# Altium project ST-Link V2.PrjPCB
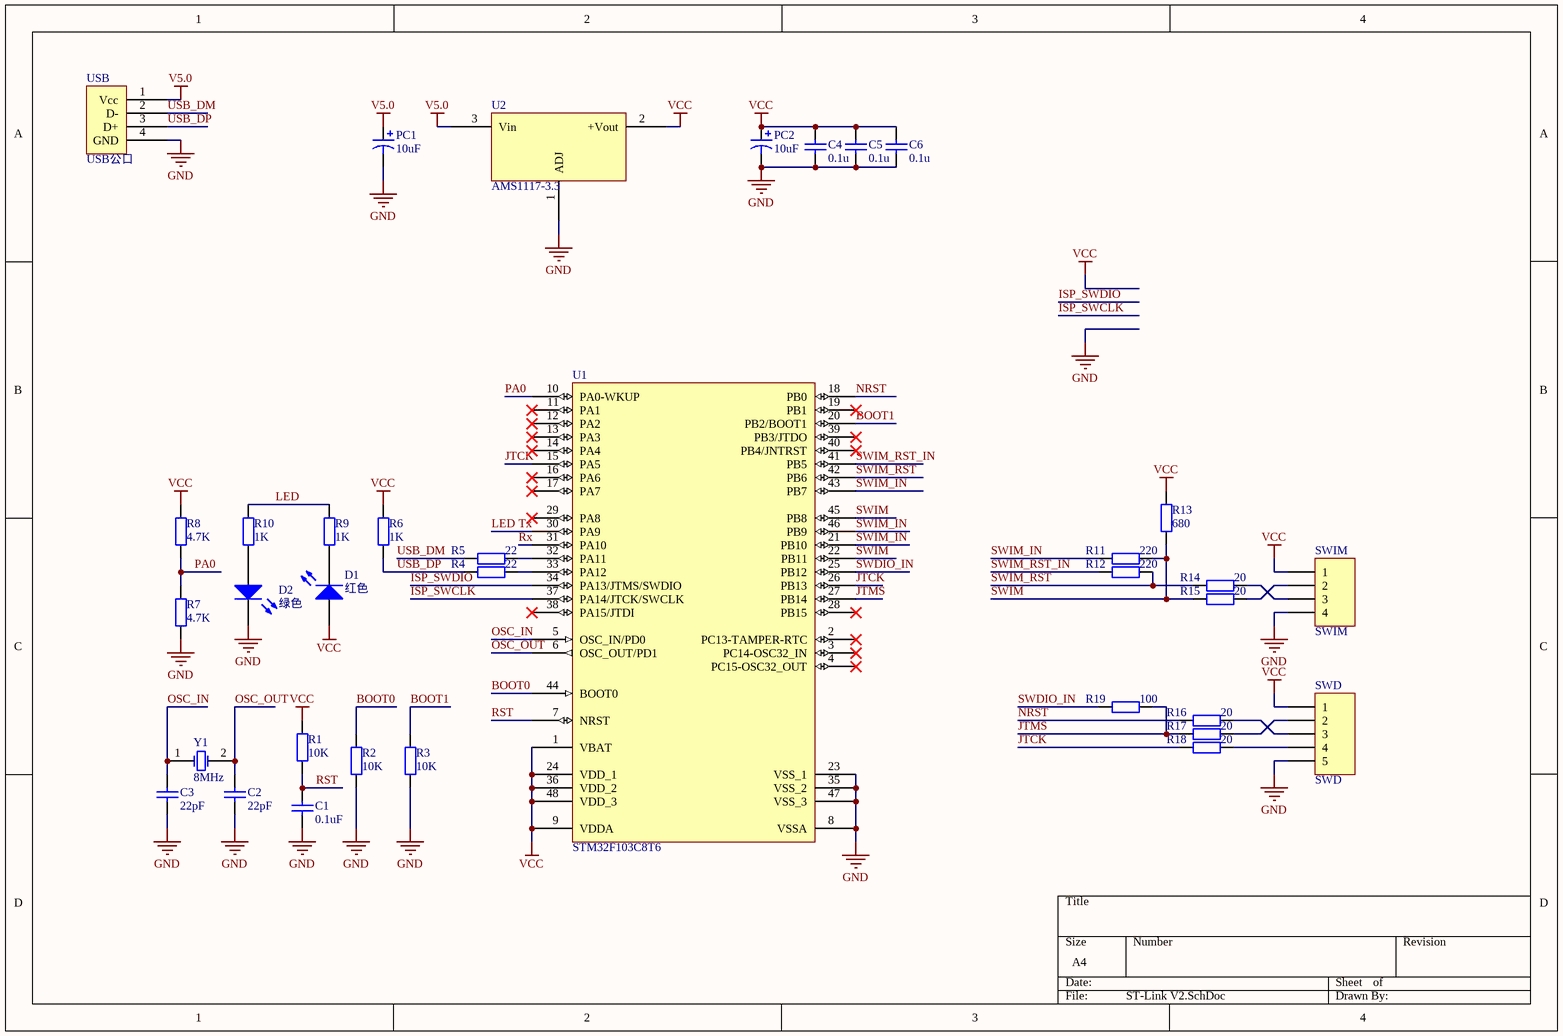
[diagram p0: ST-Link V2.SchDoc]
1 sheet, 35 parts. Net scope: global (net labels, ports and power ports of the same name join across sheets).
Board file: ST-Link V2.PcbDoc

## Sheet ST-Link V2.SchDoc
size A4

### Parts
C1  value 0.1uF  [C0603]
C2  value 22pF  [C0603]
C3  value 22pF  [C0603]
C4  value 0.1u  [C0603]
C5  value 0.1u  [C0603]
C6  value 0.1u  [C0603]
D1  红色  [LED0603]
D2  绿色  [LED0603]
PC1  value 10uF  [C1206A]
PC2  value 10uF  [C1206A]
R1  value 10K  [R0603]
R2  value 10K  [R0603]
R3  value 10K  [R0603]
R4  value 22  [R0603]
R5  value 22  [R0603]
R6  value 1K  [R0603]
R7  value 4.7K  [R0603]
R8  value 4.7K  [R0603]
R9  value 1K  [R0603]
R10  value 1K  [R0603]
R11  value 220  [R0603]
R12  value 220  [R0603]
R13  value 680  [R0603]
R14  value 20  [R0603]
R15  value 20  [R0603]
R16  value 20  [R0603]
R17  value 20  [R0603]
R18  value 20  [R0603]
R19  value 100  [R0603]
SWD  SWD  [HDR1X5]
SWIM  SWIM  [HDR1X4]
U1  STM32F103C8T6  [LQFP48_M]
U2  AMS1117-3.3  [SOT-223]
USB  USB公口  [USB-H]
Y1  8MHz  [JZ]

### Nets
GND: C1.2 C2.2 C3.2 C4.2 C5.2 C6.2 D2.2(K) PC1.2 PC2.2 R2.1 R3.1 R7.2 SWD.5 SWIM.4 U1.8(VSSA) U1.23(VSS_1) U1.35(VSS_2) U1.47(VSS_3) U2.1(ADJ) USB.4(GND)
V5.0: PC1.1 U2.3(Vin) USB.1(Vcc)
VCC: C4.1 C5.1 C6.1 D1.1(A) PC2.1 R1.2 R6.1 R8.1 R13.2 SWD.1 SWIM.1 U1.1(VBAT) U1.9(VDDA) U1.24(VDD_1) U1.36(VDD_2) U1.48(VDD_3) U2.2(+Vout)
BOOT0: R2.2 U1.44(BOOT0)
BOOT1: R3.2 U1.20(PB2/BOOT1)
ISP_SWCLK: U1.37(PA14/JTCK/SWCLK)
ISP_SWDIO: U1.34(PA13/JTMS/SWDIO)
JTCK: R18.2 U1.15(PA5) U1.26(PB13)
JTMS: R17.2 R19.1 U1.27(PB14)
LED: R9.1 R10.1 U1.30(PA9)  [also labelled Tx]
NRST: R16.2 U1.18(PB0)
OSC_IN: C3.1 U1.5(OSC_IN/PD0) Y1.1(OSC1)
OSC_OUT: C2.1 U1.6(OSC_OUT/PD1) Y1.2(OSC2)
PA0: R7.1 R8.2 U1.10(PA0-WKUP)
RST: C1.1 R1.1 U1.7(NRST)
Rx: U1.31(PA10)
SWDIO_IN: R19.2 U1.25(PB12)
SWIM: R11.2 R13.1 R15.2 U1.22(PB11) U1.45(PB8)
SWIM_IN: R11.1 U1.21(PB10) U1.43(PB7) U1.46(PB9)
SWIM_RST: R12.2 R14.2 U1.42(PB6)
SWIM_RST_IN: R12.1 U1.41(PB5)
USB_DM: R5.2 USB.2(D-)
USB_DP: R4.2 R6.2 USB.3(D+)
NetD1_2: D1.2(K) R9.2
NetD2_1: D2.1(A) R10.2
NetR4_1: R4.1 U1.33(PA12)
NetR5_1: R5.1 U1.32(PA11)
NetR14_1: R14.1 SWIM.3
NetR15_1: R15.1 SWIM.2
NetR16_1: R16.1 SWD.3
NetR17_1: R17.1 SWD.2
NetR18_1: R18.1 SWD.4

Not connected (* = marked no-connect by the designer): U1 2(PC13-TAMPER-RTC)* 3(PC14-OSC32_IN)* 4(PC15-OSC32_OUT)* 11(PA1)* 12(PA2)* 13(PA3)* 14(PA4)* 16(PA6)* 17(PA7)* 19(PB1)* 28(PB15)* 29(PA8)* 38(PA15/JTDI)* 39(PB3/JTDO)* 40(PB4/JNTRST)*

### Library data of the parts
C1-C6 = Cap: Capacitor; Published: 8-Jun-2000; LatestRevisionDate: 17-Jul-2002; LatestRevisionNote: Re-released for DXP Platform.; PackageReference: RAD-0.3; Publisher: Altium Limited
D1 D2 = LED2: Typical RED, GREEN, YELLOW, AMBER GaAs LED; Published: 8-Jun-2000; LatestRevisionDate: 17-Jul-2002; LatestRevisionNote: Re-released for DXP Platform.; PackageVersion: Feb-2002; PackageReference: 3.2X1.6X1.1; Publisher: Altium Limited
PC1 PC2 = Cap Pol3: Polarized Capacitor (Surface Mount); Published: 8-Jun-2000; LatestRevisionDate: 29-May-2009; LatestRevisionNote: IPC-7351 Footprint Added.; PackageReference: C0805; Publisher: Altium Limited; PackageDescription: Chip Capacitor
R1-R19 = Res2: Resistor; Published: 8-Jun-2000; LatestRevisionDate: 17-Jul-2002; LatestRevisionNote: Re-released for DXP Platform.; PackageReference: AXIAL-0.4; Publisher: Altium Limited
SWD = Header 5: Header, 5-Pin; LatestRevisionDate: 17-Jul-2002; LatestRevisionNote: Re-released for DXP Platform.; Publisher: Altium Limited
SWIM = Header 4: Header, 4-Pin; LatestRevisionDate: 17-Jul-2002; LatestRevisionNote: Re-released for DXP Platform.; Publisher: Altium Limited
U1 = STM32F103C8T6: STM32 ARM-based 32-bit MCU with 64 Kbytes Flash, 48-pin LQFP, Industrial Temperature; Published: 30-May-2008; DatasheetVersion: rev6, Mar-2008; PackageVersion: Mar-2008; PackageReference: LQFP48; Publisher: Altium Limited; PackageDescription: 48-Pin Low-Profile Quad Flat Pack, 7 x 7 mm Body, 0.5 mm Pitch (LQFP48); ComponentLink1Description: Manufacturer Link; ComponentLink1URL: www.st.com/stm32; ComponentLink2Description: Datasheet; ComponentLink2URL: http://www.st.com/stonline/products/literature/ds/13587.pdf
U2 = TL783C
Y1 = XTAL: Crystal Oscillator; Published: 8-Jun-2000; LatestRevisionDate: 17-Jul-2002; LatestRevisionNote: Re-released for DXP Platform.; PackageReference: R38; Publisher: Altium Limited